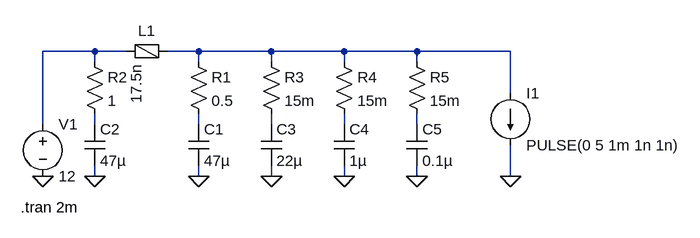
[diagram p0: schematic old_power_filter.asc]
old_power_filter.asc, the LTspice schematic file:
Version 4
SHEET 1 1096 680
WIRE 192 32 112 32
WIRE 240 32 192 32
WIRE 352 32 304 32
WIRE 464 32 352 32
WIRE 576 32 464 32
WIRE 688 32 576 32
WIRE 832 32 688 32
WIRE 192 48 192 32
WIRE 352 48 352 32
WIRE 464 48 464 32
WIRE 576 48 576 32
WIRE 688 48 688 32
WIRE 832 96 832 32
WIRE 112 144 112 32
WIRE 192 144 192 128
WIRE 352 144 352 128
WIRE 464 144 464 128
WIRE 576 144 576 128
WIRE 688 144 688 128
WIRE 192 224 192 208
WIRE 352 224 352 208
WIRE 464 224 464 208
WIRE 576 224 576 208
WIRE 688 224 688 208
WIRE 832 224 832 176
FLAG 112 224 0
FLAG 352 224 0
FLAG 832 224 0
FLAG 192 224 0
FLAG 464 224 0
FLAG 576 224 0
FLAG 688 224 0
SYMBOL voltage 112 128 R0
WINDOW 123 0 0 Left 0
WINDOW 39 24 124 Left 2
SYMATTR InstName V1
SYMATTR Value 12
SYMBOL FerriteBead 272 32 R90
WINDOW 0 -16 0 VBottom 2
SYMATTR InstName L1
SYMATTR Value 17.5n
SYMATTR SpiceLine Ipk=9.5 Rser=0.005 Rpar=18 Cpar=0
SYMBOL cap 336 144 R0
SYMATTR InstName C1
SYMATTR Value 47µ
SYMBOL res 336 32 R0
SYMATTR InstName R1
SYMATTR Value 0.5
SYMBOL current 832 96 R0
WINDOW 123 0 0 Left 0
WINDOW 39 0 0 Left 0
SYMATTR InstName I1
SYMATTR Value PULSE(0 5 1m 1n 1n)
SYMBOL cap 176 144 R0
SYMATTR InstName C2
SYMATTR Value 47µ
SYMBOL res 176 32 R0
SYMATTR InstName R2
SYMATTR Value 1
SYMBOL cap 448 144 R0
SYMATTR InstName C3
SYMATTR Value 22µ
SYMBOL res 448 32 R0
SYMATTR InstName R3
SYMATTR Value 15m
SYMBOL cap 560 144 R0
SYMATTR InstName C4
SYMATTR Value 1µ
SYMBOL res 560 32 R0
SYMATTR InstName R4
SYMATTR Value 15m
SYMBOL cap 672 144 R0
SYMATTR InstName C5
SYMATTR Value 0.1µ
SYMBOL res 672 32 R0
SYMATTR InstName R5
SYMATTR Value 15m
TEXT 78 272 Left 2 !.tran 2m

The netlist it stands for:
* old_power_filter.asc
V1 N001 0 12
L1 N002 N001 17.5n Ipk=9.5 Rser=0.005 Rpar=18 Cpar=0
C1 N004 0 47µ
R1 N002 N004 0.5
I1 N002 0 PULSE(0 5 1m 1n 1n)
C2 N003 0 47µ
R2 N001 N003 1
C3 N005 0 22µ
R3 N002 N005 15m
C4 N006 0 1µ
R4 N002 N006 15m
C5 N007 0 0.1µ
R5 N002 N007 15m
.tran 2m
.backanno
.end